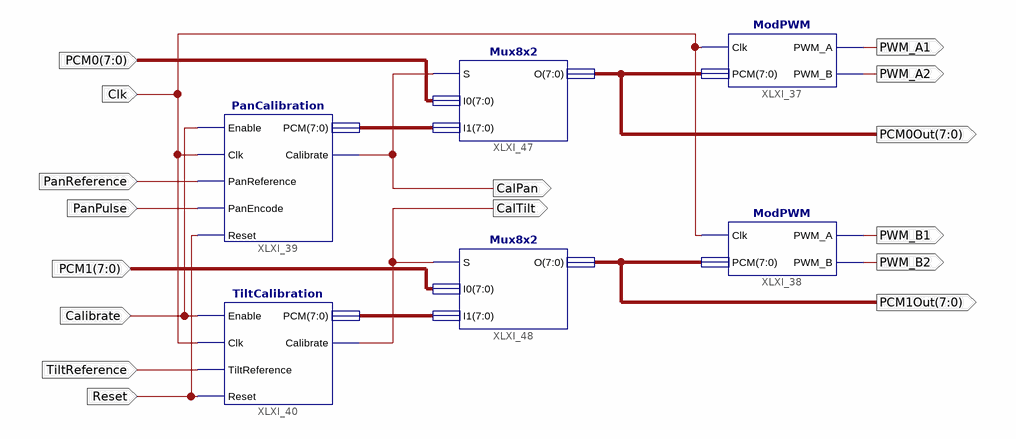
[diagram p0: schematic sheet 1]
// Xilinx ISE schematic Control.sch (spartan3e) as structural Verilog: 6 symbols, 16 ports
module Control (
  input  [7:0] PCM1,
  input  [7:0] PCM0,
  input  Calibrate,
  input  Clk,
  input  PanReference,
  input  PanPulse,
  input  TiltReference,
  input  Reset,
  output [7:0] PCM0Out,
  output [7:0] PCM1Out,
  output CalTilt,
  output CalPan,
  output PWM_A1,
  output PWM_A2,
  output PWM_B1,
  output PWM_B2
);

  wire [7:0] XLXN_3, XLXN_5;

  TiltCalibration XLXI_40 (
    .Enable(Calibrate), .Clk(Clk), .TiltReference(TiltReference), .Calibrate(CalTilt), .PCM(XLXN_3),
    .Reset(Reset));
  PanCalibration XLXI_39 (
    .Enable(Calibrate), .Clk(Clk), .PanReference(PanReference), .PanEncode(PanPulse), .Calibrate(CalPan),
    .PCM(XLXN_5), .Reset(Reset));
  Mux8x2 XLXI_48 (.S(CalTilt), .I0(PCM1), .I1(XLXN_3), .O(PCM1Out));
  Mux8x2 XLXI_47 (.S(CalPan), .I0(PCM0), .I1(XLXN_5), .O(PCM0Out));
  ModPWM XLXI_38 (.Clk(Clk), .PCM(PCM1Out), .PWM_A(PWM_B1), .PWM_B(PWM_B2));
  ModPWM XLXI_37 (.Clk(Clk), .PCM(PCM0Out), .PWM_A(PWM_A1), .PWM_B(PWM_A2));
endmodule
